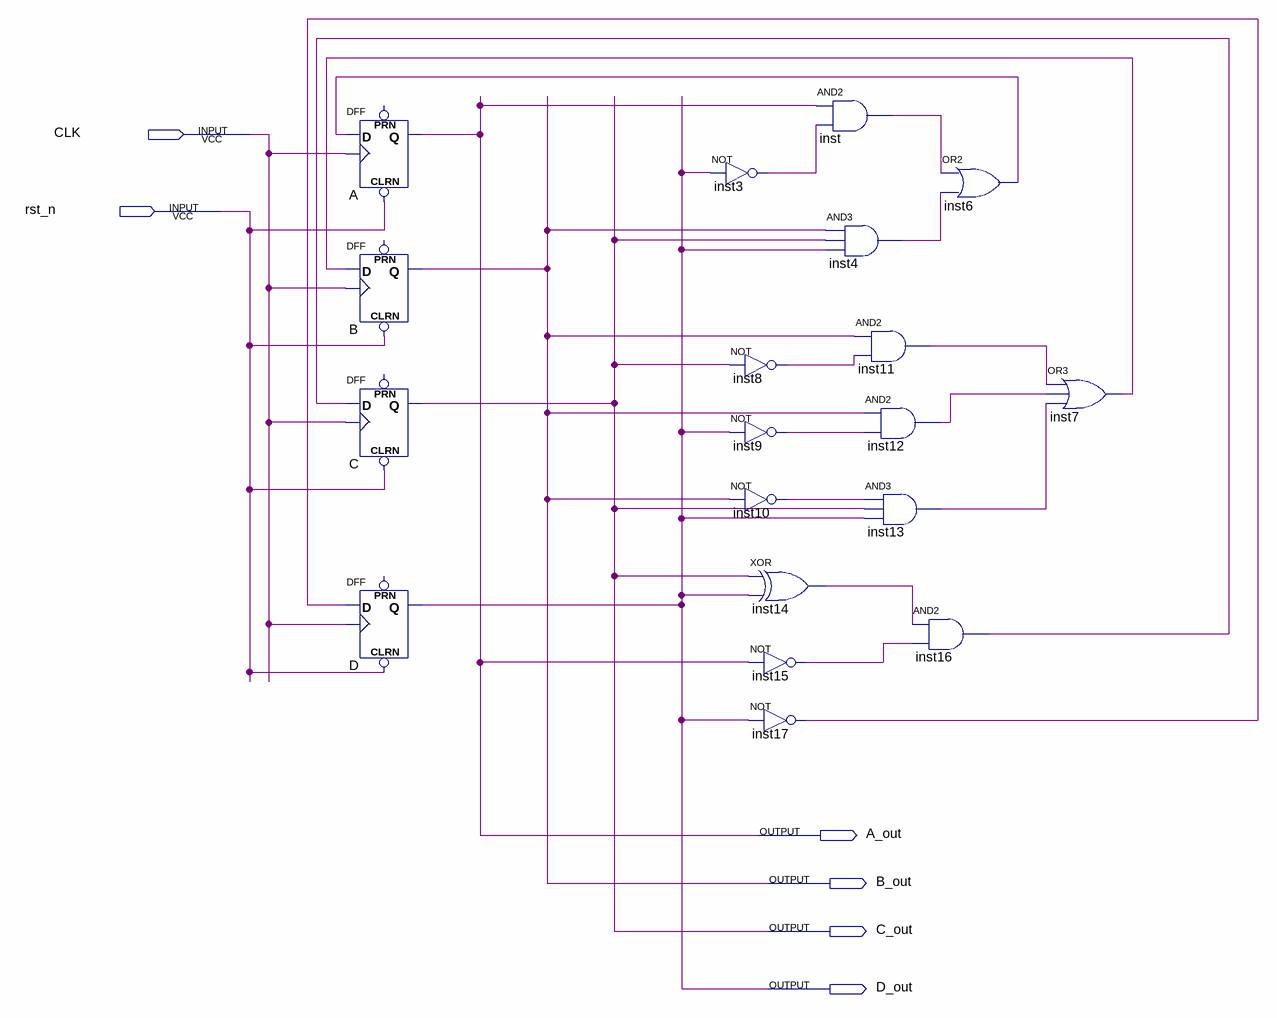
[diagram p0: schematic sheet]
// Quartus schematic counter_10.bdf as structural Verilog: 19 symbols, 6 pins
module counter_10 (
  input  CLK,
  input  rst_n,
  output A_out,
  output B_out,
  output C_out,
  output D_out
);

  wire inst3_out, inst4_out, inst6_out, inst7_out, inst8_out, inst9_out, inst10_out, inst11_out, inst12_out,
       inst13_out, inst14_out, inst15_out, inst16_out, inst17_out, inst_out;

  DFF A (.CLRN(rst_n), .CLK(CLK), .D(inst6_out), .Q(A_out));  // open: PRN
  DFF B (.CLRN(rst_n), .CLK(CLK), .D(inst7_out), .Q(B_out));  // open: PRN
  DFF C (.CLRN(rst_n), .CLK(CLK), .D(inst16_out), .Q(C_out));  // open: PRN
  DFF D (.CLRN(rst_n), .CLK(CLK), .D(inst17_out), .Q(D_out));  // open: PRN
  not inst3 (inst3_out, D_out);
  not inst8 (inst8_out, C_out);
  not inst9 (inst9_out, D_out);
  not inst10 (inst10_out, B_out);
  xor inst14 (inst14_out, C_out, D_out);
  not inst15 (inst15_out, A_out);
  not inst17 (inst17_out, D_out);
  and inst (inst_out, A_out, inst3_out);
  and inst4 (inst4_out, B_out, C_out, D_out);
  and inst11 (inst11_out, B_out, inst8_out);
  and inst12 (inst12_out, B_out, inst9_out);
  and inst13 (inst13_out, inst10_out, C_out, D_out);
  or inst6 (inst6_out, inst_out, inst4_out);
  and inst16 (inst16_out, inst14_out, inst15_out);
  or inst7 (inst7_out, inst11_out, inst12_out, inst13_out);
endmodule
